# Altium schematic sheet display.SchDoc
size A4
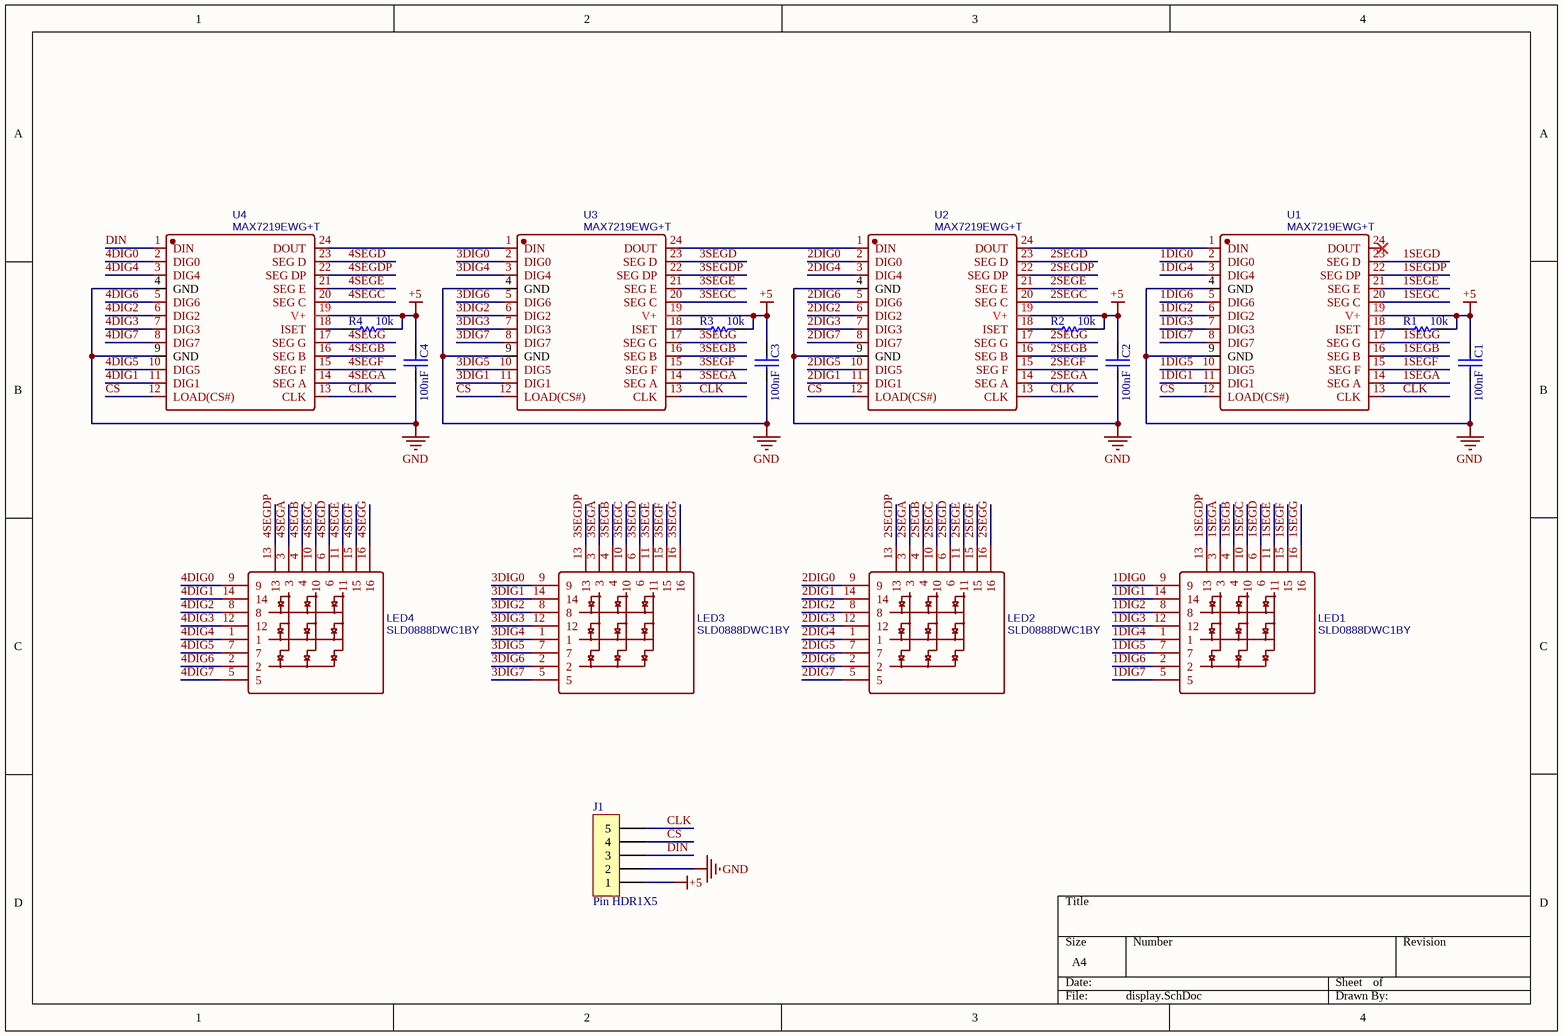
[diagram p0: display.SchDoc]

## Parts
C1  100nF  [0201C]
C2  100nF  [0201C]
C3  100nF  [0201C]
C4  100nF  [0201C]
J1  Pin HDR1X5  [Pin HDR1X5/2mm-W]
LED1  SLD0888DWC1BY  [点阵2cm]
LED2  SLD0888DWC1BY  [点阵2cm]
LED3  SLD0888DWC1BY  [点阵2cm]
LED4  SLD0888DWC1BY  [点阵2cm]
R1  10k  [0603R]
R2  10k  [0603R]
R3  10k  [0603R]
R4  10k  [0603R]
U1  MAX7219EWG+T  [MAX7219EWG]
U2  MAX7219EWG+T  [MAX7219EWG]
U3  MAX7219EWG+T  [MAX7219EWG]
U4  MAX7219EWG+T  [MAX7219EWG]

## Nets
+5: C1.2 C2.2 C3.2 C4.2 J1.1 R1.2 R2.2 R3.2 R4.2 U1.19(V+) U2.19(V+) U3.19(V+) U4.19(V+)
GND: C1.1 C2.1 C3.1 C4.1 J1.2 U1.4(GND) U1.9(GND) U2.4(GND) U2.9(GND) U3.4(GND) U3.9(GND) U4.4(GND) U4.9(GND)
1DIG0: LED1.9 U1.2(DIG0)
1DIG1: LED1.14 U1.11(DIG1)
1DIG2: LED1.8 U1.6(DIG2)
1DIG3: LED1.12 U1.7(DIG3)
1DIG4: LED1.1 U1.3(DIG4)
1DIG5: LED1.7 U1.10(DIG5)
1DIG6: LED1.2 U1.5(DIG6)
1DIG7: LED1.5 U1.8(DIG7)
1SEGA: LED1.3 U1.14(SEG_A)
1SEGB: LED1.4 U1.16(SEG_B)
1SEGC: LED1.10 U1.20(SEG_C)
1SEGD: LED1.6 U1.23(SEG_D)
1SEGDP: LED1.13 U1.22(SEG_DP)
1SEGE: LED1.11 U1.21(SEG_E)
1SEGF: LED1.15 U1.15(SEG_F)
1SEGG: LED1.16 U1.17(SEG_G)
2DIG0: LED2.9 U2.2(DIG0)
2DIG1: LED2.14 U2.11(DIG1)
2DIG2: LED2.8 U2.6(DIG2)
2DIG3: LED2.12 U2.7(DIG3)
2DIG4: LED2.1 U2.3(DIG4)
2DIG5: LED2.7 U2.10(DIG5)
2DIG6: LED2.2 U2.5(DIG6)
2DIG7: LED2.5 U2.8(DIG7)
2SEGA: LED2.3 U2.14(SEG_A)
2SEGB: LED2.4 U2.16(SEG_B)
2SEGC: LED2.10 U2.20(SEG_C)
2SEGD: LED2.6 U2.23(SEG_D)
2SEGDP: LED2.13 U2.22(SEG_DP)
2SEGE: LED2.11 U2.21(SEG_E)
2SEGF: LED2.15 U2.15(SEG_F)
2SEGG: LED2.16 U2.17(SEG_G)
3DIG0: LED3.9 U3.2(DIG0)
3DIG1: LED3.14 U3.11(DIG1)
3DIG2: LED3.8 U3.6(DIG2)
3DIG3: LED3.12 U3.7(DIG3)
3DIG4: LED3.1 U3.3(DIG4)
3DIG5: LED3.7 U3.10(DIG5)
3DIG6: LED3.2 U3.5(DIG6)
3DIG7: LED3.5 U3.8(DIG7)
3SEGA: LED3.3 U3.14(SEG_A)
3SEGB: LED3.4 U3.16(SEG_B)
3SEGC: LED3.10 U3.20(SEG_C)
3SEGD: LED3.6 U3.23(SEG_D)
3SEGDP: LED3.13 U3.22(SEG_DP)
3SEGE: LED3.11 U3.21(SEG_E)
3SEGF: LED3.15 U3.15(SEG_F)
3SEGG: LED3.16 U3.17(SEG_G)
4DIG0: LED4.9 U4.2(DIG0)
4DIG1: LED4.14 U4.11(DIG1)
4DIG2: LED4.8 U4.6(DIG2)
4DIG3: LED4.12 U4.7(DIG3)
4DIG4: LED4.1 U4.3(DIG4)
4DIG5: LED4.7 U4.10(DIG5)
4DIG6: LED4.2 U4.5(DIG6)
4DIG7: LED4.5 U4.8(DIG7)
4SEGA: LED4.3 U4.14(SEG_A)
4SEGB: LED4.4 U4.16(SEG_B)
4SEGC: LED4.10 U4.20(SEG_C)
4SEGD: LED4.6 U4.23(SEG_D)
4SEGDP: LED4.13 U4.22(SEG_DP)
4SEGE: LED4.11 U4.21(SEG_E)
4SEGF: LED4.15 U4.15(SEG_F)
4SEGG: LED4.16 U4.17(SEG_G)
CLK: J1.5 U1.13(CLK) U2.13(CLK) U3.13(CLK) U4.13(CLK)
CS: J1.4 U1.12(LOAD(CS#)) U2.12(LOAD(CS#)) U3.12(LOAD(CS#)) U4.12(LOAD(CS#))
DIN: J1.3 U4.1(DIN)
NetR1_1: R1.1 U1.18(ISET)
NetR2_1: R2.1 U2.18(ISET)
NetR3_1: R3.1 U3.18(ISET)
NetR4_1: R4.1 U4.18(ISET)
NetU1_1: U1.1(DIN) U2.24(DOUT)
NetU2_1: U2.1(DIN) U3.24(DOUT)
NetU3_1: U3.1(DIN) U4.24(DOUT)

Not connected (* = marked no-connect by the designer): U1 24(DOUT)*

## Library data of the parts
C1-C4 = CAP: 无极性电容
LED1-LED4 = SLD0888DWC1BY: BOM_Manufacturer: SUNLIGHT; Contributor: LCSC; BOM_Supplier: LCSC; BOM_Supplier Part: C225986; BOM_Manufacturer Part: SLD0888DWC1BY; spicePre: L; spiceSymbolName: SLD0888DWC1BY
R1-R4 = RES
U1-U4 = MAX7219EWG+T: BOM_Manufacturer: MAXIM; SMT Type: Extend; BOM_Supplier: LCSC; BOM_Manufacturer Part: MAX7219EWG+T; image: //image.lceda.cn/szlcsc/C52476.jpg; BOM_Supplier Part: C52476; BOM_JLCPCB SMD: Yes; spicePre: U; spiceSymbolName: MAX7219EWG+T